# Altium schematic sheet controller.SchDoc
size A
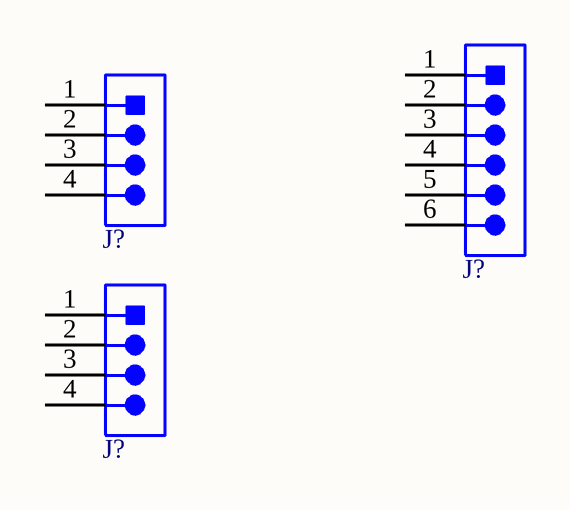
[diagram p0: controller.SchDoc]

## Parts
(Parts that share a designator on the sheet are numbered #1, #2 ... from top to bottom, then left to right.)
J?#1  S6B-ZR  [S6B-ZR]  (value not drawn)
J?#2  1744426-4  [1744426-4]  (value not drawn)
J?#3  1744426-4  [1744426-4]  (value not drawn)

## Nets

Not connected (* = marked no-connect by the designer): J?#1 1 2 3 4 5 6; J?#2 1 2 3 4; J?#3 1 2 3 4

## Library data of the parts
J?#1 = S6B-ZR: CON, HEADER, 6POS, 1.5mm, R/A, THT; Manufacturer 1: JST; Manufacturer Part Number 1: S6B-ZR
J?#2 J?#3 = 1744426-4: CON, HEADER, EP2.5, 4POS, R/A, THT; Manufacturer 1: TE Connectivity; Manufacturer Part Number 1: 1744426-4